# EAGLE design cloud-substrate (EAGLE 8.3.1)
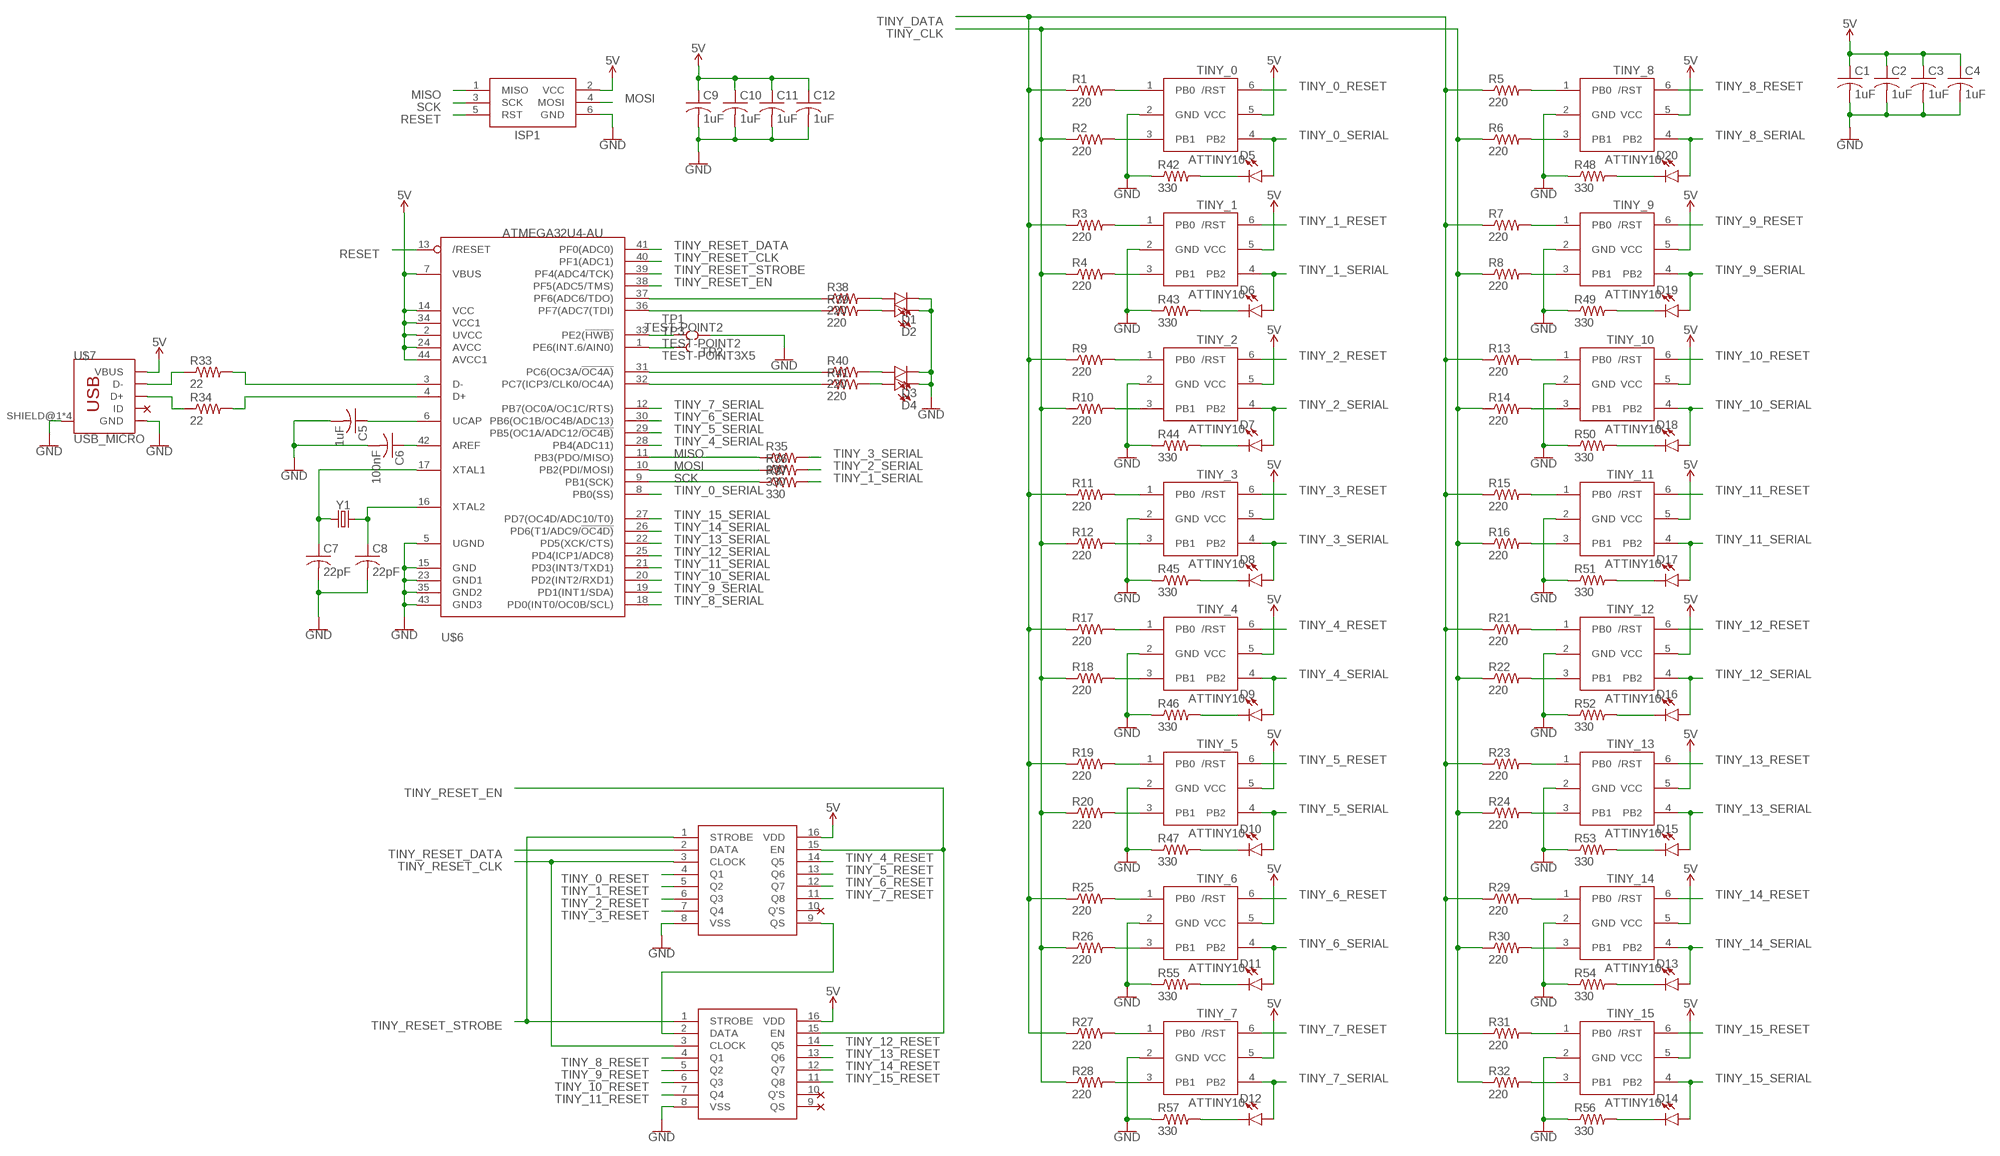
[diagram p0: schematic, sheet 1]

## Parts
C1  1uF  C-USC0805  [C0805]
C2  1uF  C-USC0805  [C0805]
C3  1uF  C-USC0805  [C0805]
C4  1uF  C-USC0805  [C0805]
C5  1uF  C-USC0402  [C0402]
C6  100nF  C-USC0402  [C0402]
C7  22pF  C-USC0402  [C0402]
C8  22pF  C-USC0402  [C0402]
C9  1uF  C-USC0805  [C0805]
C10  1uF  C-USC0805  [C0805]
C11  1uF  C-USC0805  [C0805]
C12  1uF  C-USC0805  [C0805]
D1  LED0603  [LED-0603]
D2  LED0603  [LED-0603]
D3  LED0603  [LED-0603]
D4  LED0603  [LED-0603]
D5  LED0603  [LED-0603]
D6  LED0603  [LED-0603]
D7  LED0603  [LED-0603]
D8  LED0603  [LED-0603]
D9  LED0603  [LED-0603]
D10  LED0603  [LED-0603]
D11  LED0603  [LED-0603]
D12  LED0603  [LED-0603]
D13  LED0603  [LED-0603]
D14  LED0603  [LED-0603]
D15  LED0603  [LED-0603]
D16  LED0603  [LED-0603]
D17  LED0603  [LED-0603]
D18  LED0603  [LED-0603]
D19  LED0603  [LED-0603]
D20  LED0603  [LED-0603]
ISP1  AVRISP-6  [AVRISP]
R1  220  R-US_R0402  [R0402]
R2  220  R-US_R0402  [R0402]
R3  220  R-US_R0402  [R0402]
R4  220  R-US_R0402  [R0402]
R5  220  R-US_R0402  [R0402]
R6  220  R-US_R0402  [R0402]
R7  220  R-US_R0402  [R0402]
R8  220  R-US_R0402  [R0402]
R9  220  R-US_R0402  [R0402]
R10  220  R-US_R0402  [R0402]
R11  220  R-US_R0402  [R0402]
R12  220  R-US_R0402  [R0402]
R13  220  R-US_R0402  [R0402]
R14  220  R-US_R0402  [R0402]
R15  220  R-US_R0402  [R0402]
R16  220  R-US_R0402  [R0402]
R17  220  R-US_R0402  [R0402]
R18  220  R-US_R0402  [R0402]
R19  220  R-US_R0402  [R0402]
R20  220  R-US_R0402  [R0402]
R21  220  R-US_R0402  [R0402]
R22  220  R-US_R0402  [R0402]
R23  220  R-US_R0402  [R0402]
R24  220  R-US_R0402  [R0402]
R25  220  R-US_R0402  [R0402]
R26  220  R-US_R0402  [R0402]
R27  220  R-US_R0402  [R0402]
R28  220  R-US_R0402  [R0402]
R29  220  R-US_R0402  [R0402]
R30  220  R-US_R0402  [R0402]
R31  220  R-US_R0402  [R0402]
R32  220  R-US_R0402  [R0402]
R33  22  R-US_R0402  [R0402]
R34  22  R-US_R0402  [R0402]
R35  330  R-US_R0402  [R0402]
R36  330  R-US_R0402  [R0402]
R37  330  R-US_R0402  [R0402]
R38  220  R-US_R0402  [R0402]
R39  220  R-US_R0402  [R0402]
R40  220  R-US_R0402  [R0402]
R41  220  R-US_R0402  [R0402]
R42  330  R-US_R0402  [R0402]
R43  330  R-US_R0402  [R0402]
R44  330  R-US_R0402  [R0402]
R45  330  R-US_R0402  [R0402]
R46  330  R-US_R0402  [R0402]
R47  330  R-US_R0402  [R0402]
R48  330  R-US_R0402  [R0402]
R49  330  R-US_R0402  [R0402]
R50  330  R-US_R0402  [R0402]
R51  330  R-US_R0402  [R0402]
R52  330  R-US_R0402  [R0402]
R53  330  R-US_R0402  [R0402]
R54  330  R-US_R0402  [R0402]
R55  330  R-US_R0402  [R0402]
R56  330  R-US_R0402  [R0402]
R57  330  R-US_R0402  [R0402]
TINY_0  ATTINY10  [SOT23-6]
TINY_1  ATTINY10  [SOT23-6]
TINY_2  ATTINY10  [SOT23-6]
TINY_3  ATTINY10  [SOT23-6]
TINY_4  ATTINY10  [SOT23-6]
TINY_5  ATTINY10  [SOT23-6]
TINY_6  ATTINY10  [SOT23-6]
TINY_7  ATTINY10  [SOT23-6]
TINY_8  ATTINY10  [SOT23-6]
TINY_9  ATTINY10  [SOT23-6]
TINY_10  ATTINY10  [SOT23-6]
TINY_11  ATTINY10  [SOT23-6]
TINY_12  ATTINY10  [SOT23-6]
TINY_13  ATTINY10  [SOT23-6]
TINY_14  ATTINY10  [SOT23-6]
TINY_15  ATTINY10  [SOT23-6]
TP1  TEST-POINT2  [PAD.02X.02]
TP2  TEST-POINT2  [PAD.02X.02]
TP3  TEST-POINT3X5  [PAD.03X.05]
U$1  CD4094B  [TSSOP16]
U$2  CD4094B  [TSSOP16]
U$6  ATMEGA32U4-AU  [TQFP44]
U$7  USB_MICRO  [USB_FCI_10118194]
Y1  CRYSTALSMD-3.2X2.5  [CRYSTAL-SMD-3.2X2.5MM]

## Nets
5V: C1.1 C2.1 C3.1 C4.1 C9.1 C10.1 C11.1 C12.1 ISP1.2(VCC) TINY_0.5(VCC) TINY_1.5(VCC) TINY_2.5(VCC) TINY_3.5(VCC) TINY_4.5(VCC) TINY_5.5(VCC) TINY_6.5(VCC) TINY_7.5(VCC) TINY_8.5(VCC) TINY_9.5(VCC) TINY_10.5(VCC) TINY_11.5(VCC) TINY_12.5(VCC) TINY_13.5(VCC) TINY_14.5(VCC) TINY_15.5(VCC) U$1.16(VDD) U$2.16(VDD) U$6.2(UVCC) U$6.7(VBUS) U$6.14(VCC) U$6.24(AVCC) U$6.34(VCC1) U$6.44(AVCC1) U$7.1(VBUS)
GND: C1.2 C2.2 C3.2 C4.2 C5.2 C6.2 C7.2 C8.2 C9.2 C10.2 C11.2 C12.2 D1.C D2.C D3.C D4.C ISP1.6(GND) R42.1 R43.1 R44.1 R45.1 R46.1 R47.1 R48.1 R49.1 R50.1 R51.1 R52.1 R53.1 R54.1 R55.1 R56.1 R57.1 TINY_0.2(GND) TINY_1.2(GND) TINY_2.2(GND) TINY_3.2(GND) TINY_4.2(GND) TINY_5.2(GND) TINY_6.2(GND) TINY_7.2(GND) TINY_8.2(GND) TINY_9.2(GND) TINY_10.2(GND) TINY_11.2(GND) TINY_12.2(GND) TINY_13.2(GND) TINY_14.2(GND) TINY_15.2(GND) TP2.P$1 U$1.8(VSS) U$2.8(VSS) U$6.5(UGND) U$6.15(GND) U$6.23(GND1) U$6.35(GND2) U$6.43(GND3) U$7.5(GND) U$7.SHIELD@1(SHIELD) U$7.SHIELD@2(SHIELD) U$7.SHIELD@3(SHIELD) U$7.SHIELD@4(SHIELD)
MISO: ISP1.1(MISO) R35.1 U$6.11(PB3(PDO/MISO))
MOSI: ISP1.4(MOSI) R36.1 U$6.10(PB2(PDI/MOSI))
N$1: R3.2 TINY_1.1(PB0)
N$2: R4.2 TINY_1.3(PB1)
N$3: R1.2 TINY_0.1(PB0)
N$4: R2.2 TINY_0.3(PB1)
N$5: R33.1 U$7.2(D-)
N$6: R34.1 U$7.3(D+)
N$7: R33.2 U$6.3(D-)
N$8: R34.2 U$6.4(D+)
N$9: U$1.9(QS) U$2.2(DATA)
N$10: R5.2 TINY_8.1(PB0)
N$11: R6.2 TINY_8.3(PB1)
N$12: C5.1 U$6.6(UCAP)
N$13: C6.1 U$6.42(AREF)
N$14: R7.2 TINY_9.1(PB0)
N$15: R8.2 TINY_9.3(PB1)
N$16: C7.1 U$6.17(XTAL1) Y1.1
N$17: C8.1 U$6.16(XTAL2) Y1.3
N$18: R9.2 TINY_2.1(PB0)
N$19: R10.2 TINY_2.3(PB1)
N$20: TP1.P$1 U$6.33(PE2(!HWB))
N$21: R38.1 U$6.37(PF6(ADC6/TDO))
N$22: R11.2 TINY_3.1(PB0)
N$23: R12.2 TINY_3.3(PB1)
N$24: R39.1 U$6.36(PF7(ADC7(TDI))
N$25: R40.1 U$6.31(PC6(OC3A/!OC4A))
N$26: R13.2 TINY_10.1(PB0)
N$27: R14.2 TINY_10.3(PB1)
N$28: R41.1 U$6.32(PC7(ICP3/CLK0/OC4A))
N$29: D1.A R38.2
N$30: R15.2 TINY_11.1(PB0)
N$31: R16.2 TINY_11.3(PB1)
N$32: D2.A R39.2
N$33: D3.A R40.2
N$34: R17.2 TINY_4.1(PB0)
N$35: R18.2 TINY_4.3(PB1)
N$36: D4.A R41.2
N$37: D7.C R44.2
N$38: R19.2 TINY_5.1(PB0)
N$39: R20.2 TINY_5.3(PB1)
N$40: TP3.P$1 U$6.1(PE6(INT.6/AIN0))
N$41: D8.C R45.2
N$42: R21.2 TINY_12.1(PB0)
N$43: R22.2 TINY_12.3(PB1)
N$44: D9.C R46.2
N$45: D10.C R47.2
N$46: R23.2 TINY_13.1(PB0)
N$47: R24.2 TINY_13.3(PB1)
N$48: D11.C R55.2
N$49: D12.C R57.2
N$50: R25.2 TINY_6.1(PB0)
N$51: R26.2 TINY_6.3(PB1)
N$52: D14.C R56.2
N$53: D13.C R54.2
N$54: R27.2 TINY_7.1(PB0)
N$55: R28.2 TINY_7.3(PB1)
N$56: D15.C R53.2
N$57: D16.C R52.2
N$58: R29.2 TINY_14.1(PB0)
N$59: R30.2 TINY_14.3(PB1)
N$60: D17.C R51.2
N$61: D18.C R50.2
N$62: R31.2 TINY_15.1(PB0)
N$63: R32.2 TINY_15.3(PB1)
N$64: D20.C R48.2
N$65: D19.C R49.2
N$66: D5.C R42.2
N$67: D6.C R43.2
RESET: ISP1.5(RST) U$6.13(/RESET)
SCK: ISP1.3(SCK) R37.1 U$6.9(PB1(SCK))
TINY_0_RESET: TINY_0.6(/RST) U$1.4(Q1)
TINY_0_SERIAL: D5.A TINY_0.4(PB2) U$6.8(PB0(SS))
TINY_1_RESET: TINY_1.6(/RST) U$1.5(Q2)
TINY_1_SERIAL: D6.A R37.2 TINY_1.4(PB2)
TINY_2_RESET: TINY_2.6(/RST) U$1.6(Q3)
TINY_2_SERIAL: D7.A R36.2 TINY_2.4(PB2)
TINY_3_RESET: TINY_3.6(/RST) U$1.7(Q4)
TINY_3_SERIAL: D8.A R35.2 TINY_3.4(PB2)
TINY_4_RESET: TINY_4.6(/RST) U$1.14(Q5)
TINY_4_SERIAL: D9.A TINY_4.4(PB2) U$6.28(PB4(ADC11))
TINY_5_RESET: TINY_5.6(/RST) U$1.13(Q6)
TINY_5_SERIAL: D10.A TINY_5.4(PB2) U$6.29(PB5(OC1A/ADC12/!OC4B))
TINY_6_RESET: TINY_6.6(/RST) U$1.12(Q7)
TINY_6_SERIAL: D11.A TINY_6.4(PB2) U$6.30(PB6(OC1B/OC4B/ADC13))
TINY_7_RESET: TINY_7.6(/RST) U$1.11(Q8)
TINY_7_SERIAL: D12.A TINY_7.4(PB2) U$6.12(PB7(OC0A/OC1C/RTS))
TINY_8_RESET: TINY_8.6(/RST) U$2.4(Q1)
TINY_8_SERIAL: D20.A TINY_8.4(PB2) U$6.18(PD0(INT0/OC0B/SCL))
TINY_9_RESET: TINY_9.6(/RST) U$2.5(Q2)
TINY_9_SERIAL: D19.A TINY_9.4(PB2) U$6.19(PD1(INT1/SDA))
TINY_10_RESET: TINY_10.6(/RST) U$2.6(Q3)
TINY_10_SERIAL: D18.A TINY_10.4(PB2) U$6.20(PD2(INT2/RXD1))
TINY_11_RESET: TINY_11.6(/RST) U$2.7(Q4)
TINY_11_SERIAL: D17.A TINY_11.4(PB2) U$6.21(PD3(INT3/TXD1))
TINY_12_RESET: TINY_12.6(/RST) U$2.14(Q5)
TINY_12_SERIAL: D16.A TINY_12.4(PB2) U$6.25(PD4(ICP1/ADC8))
TINY_13_RESET: TINY_13.6(/RST) U$2.13(Q6)
TINY_13_SERIAL: D15.A TINY_13.4(PB2) U$6.22(PD5(XCK/CTS))
TINY_14_RESET: TINY_14.6(/RST) U$2.12(Q7)
TINY_14_SERIAL: D13.A TINY_14.4(PB2) U$6.26(PD6(T1/ADC9/!OC4D))
TINY_15_RESET: TINY_15.6(/RST) U$2.11(Q8)
TINY_15_SERIAL: D14.A TINY_15.4(PB2) U$6.27(PD7(OC4D/ADC10/T0))
TINY_CLK: R2.1 R4.1 R6.1 R8.1 R10.1 R12.1 R14.1 R16.1 R18.1 R20.1 R22.1 R24.1 R26.1 R28.1 R30.1 R32.1
TINY_DATA: R1.1 R3.1 R5.1 R7.1 R9.1 R11.1 R13.1 R15.1 R17.1 R19.1 R21.1 R23.1 R25.1 R27.1 R29.1 R31.1
TINY_RESET_CLK: U$1.3(CLOCK) U$2.3(CLOCK) U$6.40(PF1(ADC1))
TINY_RESET_DATA: U$1.2(DATA) U$6.41(PF0(ADC0))
TINY_RESET_EN: U$1.15(EN) U$2.15(EN) U$6.38(PF5(ADC5/TMS))
TINY_RESET_STROBE: U$1.1(STROBE) U$2.1(STROBE) U$6.39(PF4(ADC4/TCK))
Unconnected: U$1.10(Q'S) U$2.9(QS) U$2.10(Q'S) U$7.4(ID)

## Library data of the parts
C1-C12 = adafruit:C-US: CAPACITOR, American symbol
D1-D20 = SparkFun-LED:LED: LED (Generic) Standard schematic elements and footprints for 5mm, 3mm, 1206, and 0603 sized LEDs. Generic LEDs with no color specified.
ISP1 = adafruit:AVRISP: AVR ISP HEADER Standard 6 pin header for AVR programming
R1-R57 = adafruit:R-US_: RESISTOR, American symbol
TINY_0 TINY_1-TINY_15 = adafruit:ATTINY10: ATtiny4/5/9/10 8-bit Microcontroller with 512/1024 Bytes In-System Programmable Flash
TP1-TP3 = SparkFun-Connectors:TEST-POINT: SparkFun Test Points Bare copper test points for troubleshooting or In-Circuit-Testing. These are used by our Production team for verifying production board runs using pogo-pins on test beds. SparkFun Products: SparkFun LSM9DS1 Breakout <https://www.sparkfun.com/products/13284> SparkFun PSOC <https://www.sparkfun.com/products/13714> SparkFun Load Cell Amplifier <https://www.sparkfun.com/products/13879>
U$1 U$2 = owen:CD4094B
U$6 = adafruit:ATMEGA32U4: http://www.ladyada.net/library/eagle
U$7 = owen:USB_MICRO
Y1 = SparkFun-Clocks:CRYSTAL: Crystals (Generic) These are passive quartz crystals, which can be used as a clock source for a microcontroller. Crystal's are two-terminal devices. They require external "load" capacitors to generate an oscillating signal.

## Board
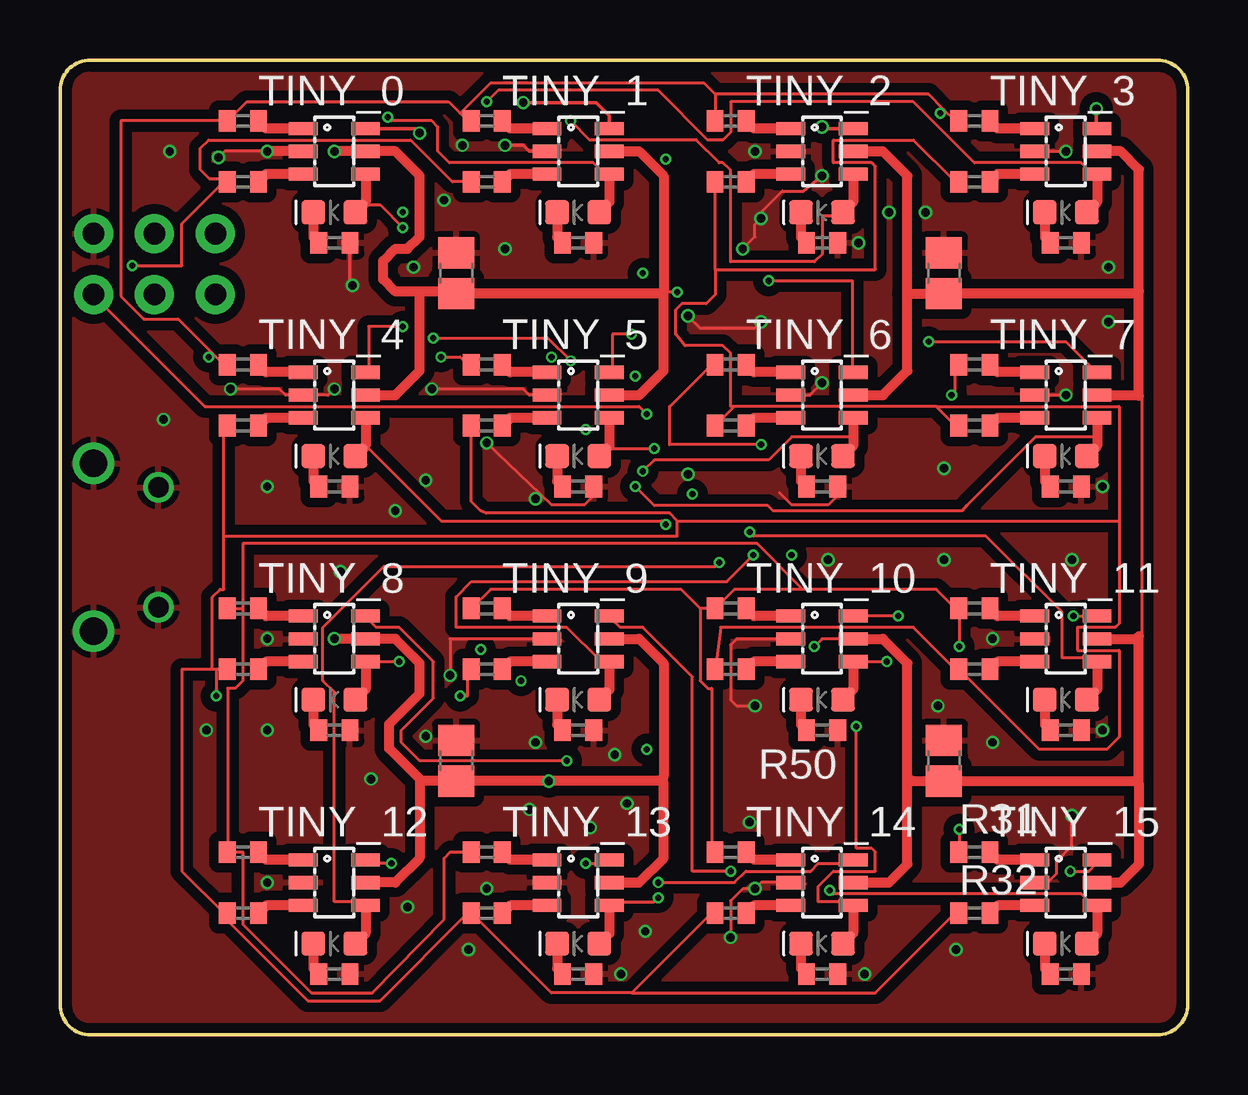
[diagram p1: board, top side]
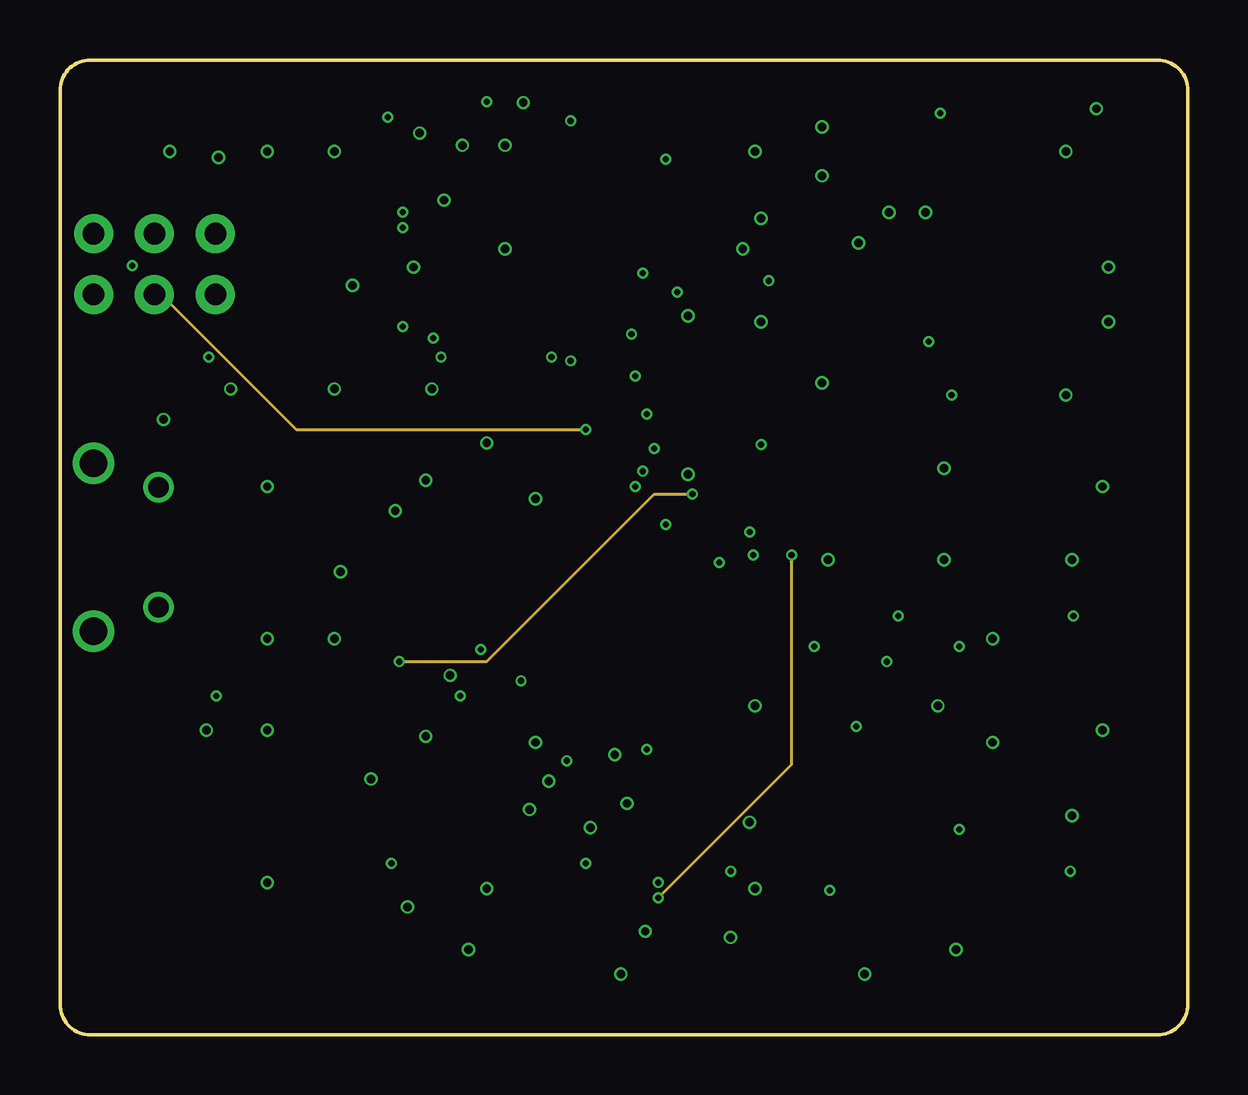
[diagram p2: board, inner layer Route2]
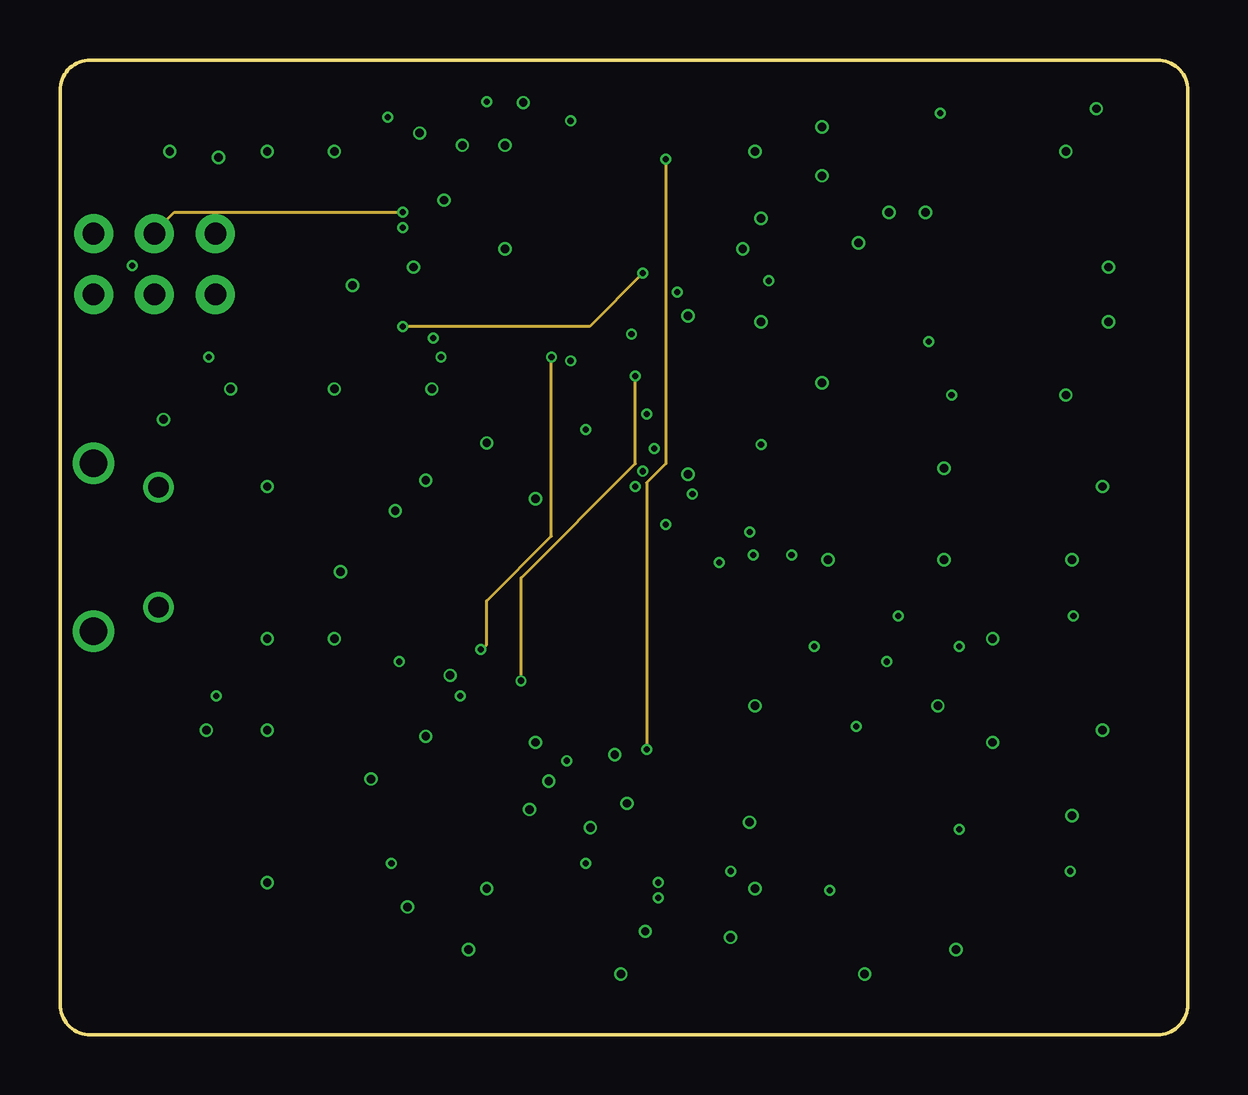
[diagram p3: board, inner layer Route15]
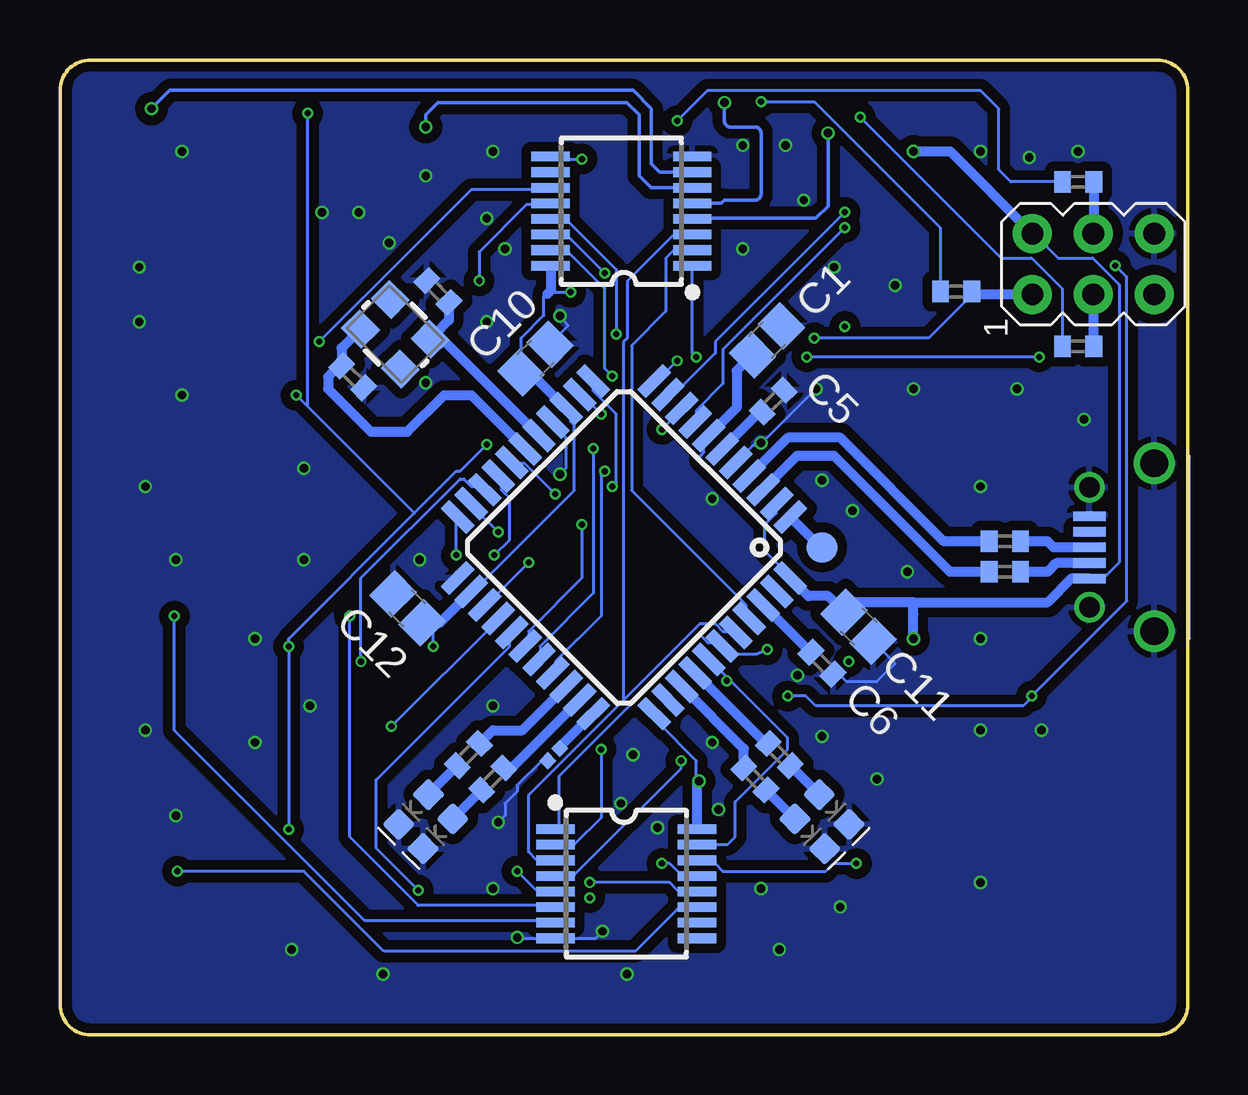
[diagram p4: board, bottom side, seen from below]

Size 46.99 x 40.64 mm. Coordinates in mm from the lower left corner, seen from the top.
Outline: 1.27,40.64 45.72,40.64 arc-90 46.99,39.37 46.99,1.27 arc-90 45.72,0 1.27,0 arc-90 0,1.27 0,39.37 arc-90 1.27,40.64
Copper layers (1*2*15*16): Top 0.035559375mm / dielectric 0.17018125mm / Route2 0.01778125mm / dielectric 47mil / Route15 0.01778125mm / dielectric 0.17018125mm / Bottom 0.035559375mm
Design rules "OSHPark-4layer": minimum track width 5mil, minimum drill 10mil, track to track 5mil, track to pad 5mil, pad to pad 5mil, via to via 5mil, smd to smd 5mil, copper to edge 15mil, drill to drill 6mil, minimum pad ring 4mil, minimum via ring 4mil, stop-mask expansion 2.5mil, vias tented up to drill 0mil, thermal gap 10mil

### Footprints (pad centres in the part's own frame; a part is rotated, then mirrored left to right if it is on the bottom)
C0805 = smd 1.3 x 1.5: 1 -0.85,0; 2 0.85,0
C0402 = smd 0.7 x 0.9: 1 -0.65,0; 2 0.65,0
LED-0603 = smd 1 x 1: A -0.877,0; C 0.877,0
AVRISP = drill 0.9 pad 1.626: 1 -1.27,2.54; 2 1.27,2.54; 3 -1.27,0; 4 1.27,0; 5 -1.27,-2.54; 6 1.27,-2.54
R0402 = smd 0.7 x 0.9: 1 -0.65,0; 2 0.65,0
SOT23-6 = smd 0.55 x 1.2: 1 -0.95,-1.3; 2 0,-1.3; 3 0.95,-1.3; 4 0.95,1.3; 5 0,1.3; 6 -0.95,1.3
PAD.02X.02 = smd 0.508 x 0.508: P$1 0,0
PAD.03X.05 = smd 1.27 x 1.27: P$1 0,0
TSSOP16 = smd 0.4 x 1.6: 1 -2.225,-2.85; 2 -1.575,-2.85; 3 -0.925,-2.85; 4 -0.275,-2.85; 5 0.375,-2.85; 6 1.025,-2.85; 7 1.675,-2.85; 8 2.325,-2.85; 9 2.325,3.05; 10 1.675,3.05; 11 1.025,3.05; 12 0.375,3.05; 13 -0.275,3.05; 14 -0.925,3.05; 15 -1.575,3.05; 16 -2.225,3.05
TQFP44 = smd 1.5 x 0.5: 1 -5.8,4; 2 -5.8,3.2; 3 -5.8,2.4; 4 -5.8,1.6; 5 -5.8,0.8; 6 -5.8,0; 7 -5.8,-0.8; 8 -5.8,-1.6; 9 -5.8,-2.4; 10 -5.8,-3.2; 11 -5.8,-4; 23 5.8,-4; 24 5.8,-3.2; 25 5.8,-2.4; 26 5.8,-1.6; 27 5.8,-0.8; 28 5.8,0; 29 5.8,0.8; 30 5.8,1.6; 31 5.8,2.4; 32 5.8,3.2; 33 5.8,4 | smd 0.5 x 1.5: 12 -4,-5.8; 13 -3.2,-5.8; 14 -2.4,-5.8; 15 -1.6,-5.8; 16 -0.8,-5.8; 17 0,-5.8; 18 0.8,-5.8; 19 1.6,-5.8; 20 2.4,-5.8; 21 3.2,-5.8; 22 4,-5.8; 34 4,5.8; 35 3.2,5.8; 36 2.4,5.8; 37 1.6,5.8; 38 0.8,5.8; 39 0,5.8; 40 -0.8,5.8; 41 -1.6,5.8; 42 -2.4,5.8; 43 -3.2,5.8; 44 -4,5.8
USB_FCI_10118194 = smd 0.4 x 1.35: 1 -1.3,2.7; 2 -0.65,2.7; 3 0,2.7; 4 0.65,2.7; 5 1.3,2.7 | drill 0.85: SHIELD@1 -2.5,2.7; SHIELD@2 2.5,2.7 | drill 1.15: SHIELD@3 -3.5,0; SHIELD@4 3.5,0
CRYSTAL-SMD-3.2X2.5MM = smd 1.2 x 1.1: 1 -1.175,-0.875; 2 1.175,-0.875; 3 1.175,0.875; 4 -1.175,0.875

### Placement (x,y rotation side)
C1  17.53,28.96 45 bottom
C2  16.51,11.43 90 top
C3  36.83,11.43 90 top
C4  36.83,31.75 90 top
C5  17.27,26.42 45 bottom
C6  15.24,15.49 315 bottom
C7  34.8,27.43 315 bottom
C8  31.24,30.99 135 bottom
C9  16.51,31.75 90 top
C10  27.18,28.19 45 bottom
C11  13.72,17.02 315 bottom
C12  32.51,17.78 135 bottom
D1  14.73,9.4 315 bottom
D2  15.75,8.38 315 bottom
D3  32.26,9.4 225 bottom
D4  31.24,8.38 225 bottom
D5  11.43,34.29 180 top
D6  21.59,34.29 180 top
D7  31.75,34.29 180 top
D8  41.91,34.29 180 top
D9  11.43,24.13 180 top
D10  21.59,24.13 180 top
D11  31.75,24.13 180 top
D12  41.91,24.13 180 top
D13  31.75,3.81 180 top
D14  41.91,3.81 180 top
D15  21.59,3.81 180 top
D16  11.43,3.81 180 top
D17  41.91,13.97 180 top
D18  31.75,13.97 180 top
D19  21.59,13.97 180 top
D20  11.43,13.97 180 top
ISP1  3.94,32.13 90 bottom
R1  7.62,38.1 0 top
R2  7.62,35.56 0 top
R3  17.78,38.1 0 top
R4  17.78,35.56 0 top
R5  7.62,17.78 0 top
R6  7.62,15.24 0 top
R7  17.78,17.78 0 top
R8  17.78,15.24 0 top
R9  27.94,38.1 0 top
R10  27.94,35.56 0 top
R11  38.1,38.1 0 top
R12  38.1,35.56 0 top
R13  27.94,17.78 0 top
R14  27.94,15.24 0 top
R15  38.1,17.78 0 top
R16  38.1,15.24 0 top
R17  7.62,27.94 0 top
R18  7.62,25.4 0 top
R19  17.78,27.94 0 top
R20  17.78,25.4 0 top
R21  7.62,7.62 0 top
R22  7.62,5.08 0 top
R23  17.78,7.62 0 top
R24  17.78,5.08 0 top
R25  27.94,27.94 0 top
R26  27.94,25.4 0 top
R27  38.1,27.94 0 top
R28  38.1,25.4 0 top
R29  27.94,7.62 0 top
R30  27.94,5.08 0 top
R31  38.1,7.62 0 top
R32  38.1,5.08 0 top
R33  7.62,19.3 180 bottom
R34  7.62,20.57 180 bottom
R35  9.65,30.99 180 bottom
R36  4.57,35.56 180 bottom
R37  4.57,28.7 180 bottom
R38  17.02,11.68 315 bottom
R39  18.03,10.67 315 bottom
R40  29.97,11.68 225 bottom
R41  28.96,10.67 225 bottom
R42  11.43,33.02 180 top
R43  21.59,33.02 180 top
R44  31.75,33.02 180 top
R45  41.91,33.02 180 top
R46  11.43,22.86 180 top
R47  21.59,22.86 180 top
R48  11.43,12.7 180 top
R49  21.59,12.7 180 top
R50  31.75,12.7 180 top
R51  41.91,12.7 180 top
R52  11.43,2.54 180 top
R53  21.59,2.54 180 top
R54  31.75,2.54 180 top
R55  31.75,22.86 180 top
R56  41.91,2.54 180 top
R57  41.91,22.86 180 top
TINY_0  11.43,36.83 270 top
TINY_1  21.59,36.83 270 top
TINY_2  31.75,36.83 270 top
TINY_3  41.91,36.83 270 top
TINY_4  11.43,26.67 270 top
TINY_5  21.59,26.67 270 top
TINY_6  31.75,26.67 270 top
TINY_7  41.91,26.67 270 top
TINY_8  11.43,16.51 270 top
TINY_9  21.59,16.51 270 top
TINY_10  31.75,16.51 270 top
TINY_11  41.91,16.51 270 top
TINY_12  11.43,6.35 270 top
TINY_13  21.59,6.35 270 top
TINY_14  31.75,6.35 270 top
TINY_15  41.91,6.35 270 top
TP1  26.16,11.94 315 bottom
TP2  26.67,11.43 315 bottom
TP3  15.24,20.32 0 bottom
U$1  23.5,34.29 90 bottom
U$2  23.5,6.35 270 bottom
U$6  23.5,20.32 225 bottom
U$7  1.4,20.32 90 bottom
Y1  33.02,29.21 315 bottom

### Tracks (layer width: path | path; a pad name or v marks a point on that pad's centre or on a via)
5V  (via drill 0.25, 0.35)
  Top 0.127: 25.15,30.8 25.24,30.8 25.12,30.9 25.24,30.96 v25.72,30.96 | v31.43,16.19 31.75,16.51 TINY_10.5 | 44.96,26.63 45.09,26.51 45.09,16.67 44.96,16.61
  Top 0.406: 25.09,10.58 v20.37,10.58 C2.1 15.08,10.58 14.99,10.67 | 44.96,30.99 44.87,30.9 C4.1 35.29,30.9 35.31,30.92 | 44.96,30.99 44.96,36.07 44.2,36.83 TINY_3.5 | TINY_15.5 44.2,6.35 44.96,7.11 44.96,10.46 | 44.96,10.46 44.96,16.61 44.86,16.51 TINY_11.5 | 44.96,30.99 44.96,26.63 44.92,26.67 TINY_7.5 | 14.99,30.99 13.97,30.99 13.46,31.5 13.46,32.26 13.97,32.77 14.48,32.77 14.99,33.27 14.99,35.81 13.97,36.83 TINY_0.5 v11.43,36.83 | 14.99,30.99 16.42,30.99 C9.1 25.12,30.9 25.15,30.93 25.15,35.81 24.13,36.83 TINY_1.5 | TINY_2.5 34.29,36.83 35.31,35.81 35.31,30.92 | TINY_4.5 13.97,26.67 14.99,27.69 14.99,30.99 | TINY_5.5 24.13,26.67 25.15,27.69 25.15,30.8 25.15,30.83 | TINY_6.5 34.29,26.67 35.31,27.69 35.31,30.92 | 44.96,10.46 44.84,10.58 C3.1 35.46,10.58 35.31,10.74 | 14.99,10.67 13.72,11.94 13.72,12.95 14.99,14.22 14.99,15.49 13.97,16.51 TINY_8.5 v11.43,16.51 | 14.99,10.67 14.99,7.37 13.97,6.35 TINY_12.5 | TINY_9.5 24.13,16.51 25.15,15.49 25.15,10.77 25.09,10.58 | TINY_10.5 34.29,16.51 35.31,15.49 35.31,10.74 | TINY_13.5 24.13,6.35 25.15,7.37 25.15,10.52 25.09,10.58 | TINY_14.5 34.54,6.35 35.31,7.11 35.31,10.74
  Bottom 0.127: U$6.34 22.07,13.33 22.07,13.02 20.48,11.43 20.48,10.64 v20.37,10.58 | 17.62,21.27 17.14,21.75 17.14,22.07 U$6.2 | 17.62,21.27 17.62,20.16 16.67,19.21 U$6.44 | 17.62,21.27 20.32,23.97 20.32,24.13 20.16,24.29 20.16,24.92 U$6.7 | 26.67,30.9 26.83,30.8 26.83,30 27.78,29.05 27.78,27.78 C10.1 | U$6.14 25.72,26.03 25.72,25.56 25.56,25.4 25.56,22.7 29.69,18.57 U$6.24 | v25.72,30.96 26.35,30.96 26.55,31.02 | v31.43,16.19 31.43,16.99 C12.1 | U$7.1 3.97,19.05 3.49,19.05 2.86,19.69 2.86,31.27 3.97,32.38 5.4,32.38 6.35,33.34 ISP1.2
  Bottom 0.406: C11.1 | C11.1 14.99,18.29 15.81,18.29 U$6.44 | U$6.7 18.8,26.15 18.8,27.69 C1.1 | C10.1 27.37,27.59 U$6.14 | C12.1 31.16,17.18 U$6.24 | C11.1 14.13,17.62 | U$7.1 4.86,19.02 5.84,18.03 11.43,18.03 | U$1.16 26.55,31.02 26.67,30.9 | U$2.16 20.45,10.5 v20.37,10.58 | C11.1 13.9,18.03 11.43,18.03 | v11.43,16.51 11.43,17.53 11.43,18.03 | v11.43,36.83 9.91,36.83 ISP1.2
GND  (via drill 0.35)
  Top 0.127: v8.64,36.83 6.86,36.83 v6.6,36.58 | TINY_3.2 v41.91,36.83 | TINY_7.2 v41.91,26.67 | TINY_15.2 41.15,6.35 41.53,6.73 41.53,7.24 42.16,7.87 v42.16,9.14 | v11.43,26.92 11.18,26.67 TINY_4.2 9.4,26.67 9.14,26.92 v7.11,26.92 | v31.75,35.81 30.99,35.18 30.1,35.18 29.21,34.29 v29.21,34.04 28.96,33.78 28.96,33.27 v28.45,32.77 | R55.1 32.4,22.49 32,22.1 30.48,22.1 29.97,22.61 | R47.1 22.24,22.49 21.84,22.1 20.48,22.1 v17.78,24.67 | TINY_5.2 19.56,26.67 19.3,26.92 v15.49,26.92 | TINY_9.2 16.26,16.51 v16.26,14.99 | TINY_6.2 31.24,26.67 v31.75,27.18 | TINY_14.2 29.21,6.35 v28.96,6.1 28.45,6.1 27.94,5.59 v27.94,4.06 | TINY_10.2 28.19,16.51 27.94,16.26 27.94,13.97 28.19,13.72 v28.96,13.72 | v26.16,29.97 26.67,29.46 28.96,29.46 v29.21,29.72
  Top 0.152: R42.1 12.08,31.35 v12.19,31.24 | TINY_1.2 19.56,36.83 19.3,37.08 v18.54,37.08
  Top 0.406: TINY_0.2 v8.64,36.83
  Bottom 0.127: 32.07,7.94 D4.C | C6.2 14.53,15.03 14.22,14.73 12.95,14.73 12.19,15.49 | 12.19,15.49 | 12.19,15.49 C11.2 | C10.2 25.81,29.56 v26.16,29.97 | U$6.15 26.47,25.45 25.91,24.89 25.91,23.62 v26.16,23.37 | U$6.5 18.14,24.55 v17.78,24.67 17.87,24.55 v15.49,26.92 | TP2.P$1 26.92,11.43 27.94,10.41 27.94,10.16 28.45,9.65 28.45,9.14 v28.73,8.86 | v27.94,4.06 27.9,4.02 U$2.8 24.68,4.02 v24.38,4.32
  other vias: 18.54,32.77 4.32,25.65 8.64,22.86 13.97,21.84 8.64,12.7 6.1,12.7 17.02,3.56 37.34,3.56 23.11,11.68 23.62,9.65 22.1,8.64 11.68,19.3 43.69,29.72 42.16,19.81 36.83,19.81 32,19.81 36.83,23.62 36.07,34.29 34.54,34.29 33.27,33.02 28.96,36.83 16,34.8 16.76,37.08 4.57,36.83 14.73,32 43.69,32 43.43,22.86 38.86,16.51 43.43,12.7 12.95,10.67 19.81,12.19 19.56,9.4 14.48,5.33 8.64,6.35 15.24,12.45 8.64,16.51 15.24,23.11 19.81,22.35 23.37,2.54 33.53,2.54 36.58,13.72 38.86,12.19 17.78,6.1
  pour Bottom (isolate 0.406): 0,39.37 0,1.27 arc90 1.27,0 45.72,0 arc90 46.99,1.27 46.99,39.37 arc90 45.72,40.64 1.27,40.64 arc90
  pour Top (isolate 0.406): 0,39.37 0,1.27 arc90 1.27,0 45.72,0 arc90 46.99,1.27 46.99,39.37 arc90 45.72,40.64 1.27,40.64 arc90
MISO  (via drill 0.25)
  Top 0.127: v21.27,28.1 20.32,29.05 v15.56,29.05
  Bottom 0.127: v21.27,28.1 22.07,27.3 U$6.11 | v15.56,29.05 10.8,29.05 9.05,30.8 R35.1
  Bottom 0.406: ISP1.1 8.88,30.86 R35.1
MOSI  (via drill 0.25)
  Route15 0.127: v14.29,34.29 4.76,34.29 3.97,33.5 ISP1.4
  Bottom 0.127: v14.29,34.29 19.69,28.89 19.69,28.42 21.27,26.83 21.59,26.83 U$6.10
  Bottom 0.406: R36.1 3.92,33.42 ISP1.4
N$1
  Top 0.406: TINY_1.1 18.75,37.78 R3.2
N$2
  Top 0.406: TINY_1.3 18.75,35.88 R4.2
N$3
  Top 0.406: TINY_0.1 8.59,37.78 R1.2
N$4
  Top 0.406: TINY_0.3 8.59,35.88 R2.2
N$5
  Bottom 0.406: U$7.2 5.48,19.67 5.84,19.3 R33.1
N$6
  Bottom 0.406: U$7.3 5.59,20.32 5.84,20.57 R34.1
N$7
  Bottom 0.406: U$6.3 16.29,24.13 14.73,24.13 9.91,19.3 R33.2
N$8
  Bottom 0.406: U$6.4 16.66,24.89 14.48,24.89 10.16,20.57 R34.2
N$9  (via drill 0.25)
  Route15 0.127: v24.45,11.91 24.45,23.02 25.24,23.81 v25.24,36.51
  Bottom 0.127: v24.45,11.91 24.45,9.05 25.56,7.94 26.19,7.94 U$2.2 | v25.24,36.51 26.51,36.51 U$1.9
N$10
  Top 0.406: TINY_8.1 8.59,17.46 R5.2
N$11
  Top 0.406: TINY_8.3 8.59,15.56 R6.2
N$12
  Bottom 0.406: C5.1 17.86,25.96 U$6.6
N$13
  Bottom 0.406: C6.1 15.73,15.95 U$6.42
N$14
  Top 0.406: TINY_9.1 18.75,17.46 R7.2
N$15
  Top 0.406: TINY_9.3 18.75,15.56 R8.2
N$16
  Bottom 0.406: Y1.1 35.26,28.63 C7.1 35.35,27.89 35.81,27.43 35.81,26.92 34.04,25.15 32.51,25.15 30.99,26.67 29.84,26.67 U$6.17
N$17
  Bottom 0.406: C8.1 30.78,29.79 31.31,29.26 | 31.31,29.26 Y1.3 | U$6.16 31.31,29.26
N$18
  Top 0.406: TINY_2.1 28.91,37.78 R9.2
N$19
  Top 0.406: TINY_2.3 28.91,35.88 R10.2
N$20
  Bottom 0.406: TP1.P$1 26.16,12 U$6.33
N$21
  Bottom 0.406: R38.1 17.58,12.14 U$6.37
N$22
  Top 0.406: TINY_3.1 39.07,37.78 R11.2
N$23
  Top 0.406: TINY_3.3 39.07,35.88 R12.2
N$24
  Bottom 0.406: R39.1 18.49,11.92 U$6.36
N$25
  Bottom 0.406: R40.1 28.96,12.7 27.72,12.7 U$6.31
N$26
  Top 0.406: TINY_10.1 28.91,17.46 R13.2
N$27
  Top 0.406: TINY_10.3 28.91,15.56 R14.2
N$28
  Bottom 0.406: R41.1 28.16,11.13 U$6.32
N$29
  Bottom 0.406: R38.2 D1.A
N$30
  Top 0.406: TINY_11.1 39.07,17.46 R15.2
N$31
  Top 0.406: TINY_11.3 39.07,15.56 R16.2
N$32
  Bottom 0.406: R39.2 D2.A
N$33
  Bottom 0.406: R40.2 D3.A
N$34
  Top 0.406: TINY_4.1 8.59,27.62 R17.2
N$35
  Top 0.406: TINY_4.3 8.59,25.72 R18.2
N$36
  Bottom 0.406: R41.2 D4.A
N$37
  Top 0.406: D7.C 30.87,33.25 R44.2
N$38
  Top 0.406: TINY_5.1 18.75,27.62 R19.2
N$39
  Top 0.406: TINY_5.3 18.75,25.72 R20.2
N$40
  Bottom 0.406: TP3.P$1 15.29,20.32 U$6.1
N$41
  Top 0.406: D8.C 41.03,33.25 R45.2
N$42
  Top 0.406: TINY_12.1 8.59,7.3 R21.2
N$43
  Top 0.406: TINY_12.3 8.59,5.4 R22.2
N$44
  Top 0.406: D9.C 10.55,23.09 R46.2
N$45
  Top 0.406: D10.C 20.71,23.09 R47.2
N$46
  Top 0.406: TINY_13.1 18.75,7.3 R23.2
N$47
  Top 0.406: TINY_13.3 18.75,5.4 R24.2
N$48
  Top 0.406: D11.C 30.87,23.09 R55.2
N$49
  Top 0.406: D12.C 41.03,23.09 R57.2
N$50
  Top 0.406: TINY_6.1 28.91,27.62 R25.2
N$51
  Top 0.406: TINY_6.3 28.91,25.72 R26.2
N$52
  Top 0.406: D14.C 41.03,2.77 R56.2
N$53
  Top 0.406: D13.C 30.87,2.77 R54.2
N$54
  Top 0.406: TINY_7.1 39.07,27.62 R27.2
N$55
  Top 0.406: TINY_7.3 39.07,25.72 R28.2
N$56
  Top 0.406: D15.C 20.71,2.77 R53.2
N$57
  Top 0.406: D16.C 10.55,2.77 R52.2
N$58
  Top 0.406: TINY_14.1 28.91,7.3 R29.2
N$59
  Top 0.406: TINY_14.3 28.91,5.4 R30.2
N$60
  Top 0.406: D17.C 41.03,12.93 R51.2
N$61
  Top 0.406: D18.C 30.87,12.93 R50.2
N$62
  Top 0.406: TINY_15.1 39.07,7.3 R31.2
N$63
  Top 0.406: TINY_15.3 39.07,5.4 R32.2
N$64
  Top 0.406: D20.C 10.55,12.93 R48.2
N$65
  Top 0.406: D19.C 20.71,12.93 R49.2
N$66
  Top 0.406: D5.C 10.55,33.25 R42.2
N$67
  Top 0.406: D6.C 20.71,33.25 R43.2
RESET  (via drill 0.25)
  Top 0.127: v24.45,25.88 24.13,26.19 6.03,26.19 1.43,30.8 ISP1.5
  Bottom 0.127: v24.45,25.88 25.24,26.67 U$6.13
SCK  (via drill 0.25)
  Route2 0.127: v21.91,25.24 9.84,25.24 4.29,30.8 3.97,30.8 ISP1.3
  Bottom 0.127: v21.91,25.24 21.11,26.03 U$6.9
  Bottom 0.406: R37.1 3.92,30.85 ISP1.3
TINY_0_RESET  (via drill 0.35)
  Top 0.152: TINY_0.6 14.8,37.78 v14.99,37.59
  Bottom 0.152: v14.99,37.59 14.99,34.54 15.49,34.04 20.62,34.04 U$1.4
TINY_0_SERIAL  (via drill 0.25)
  Top 0.127: v14.29,33.66 13.34,34.61 12.86,34.61 12.73,34.71
  Top 0.406: TINY_0.4 12.73,34.71 D5.A
  Bottom 0.127: v14.29,33.66 19.37,28.58 19.37,27.15 20.48,26.03 20.48,25.56 U$6.8
TINY_1_RESET  (via drill 0.35)
  Top 0.152: TINY_1.6 22.89,38.32 22.35,38.86 v19.3,38.86
  Bottom 0.152: U$1.5 19.44,34.66 19.3,34.8 18.03,34.8 arc-90 17.78,35.05 17.78,37.59 arc-90 18.03,37.85 19.05,37.85 arc90 19.3,38.1 v19.3,38.86
TINY_1_SERIAL  (via drill 0.25)
  Top 0.127: v13.65,38.26 13.81,38.1 15.49,38.1 15.75,37.85 15.75,36.83 16.22,36.35 22.23,36.35 22.7,35.88 TINY_1.4
  Top 0.406: TINY_1.4 22.89,34.71 D6.A
  Bottom 0.127: v13.65,38.26 7.78,32.38 6.51,32.38 5.24,31.11 5.24,28.73 R37.2
TINY_2_RESET  (via drill 0.35)
  Top 0.152: 33.02,37.81 TINY_2.6 31.82,37.78 v31.75,37.85
  Bottom 0.152: U$1.6 22.36,35.31 22.86,35.81 22.86,38.35 23.37,38.86 31.24,38.86 31.75,38.35 v31.75,37.85
TINY_2_SERIAL  (via drill 0.25)
  Top 0.127: v21.27,38.1 22.07,37.31 26.51,37.31 27.46,36.35 27.62,36.35 27.94,36.04 27.94,32.23 31.43,32.23 31.75,32.54 31.75,34.13 32.54,34.13 D7.A
  Top 0.406: TINY_2.4 33.05,34.71 D7.A
  Bottom 0.127: v21.27,38.1 20,39.37 8.64,39.37 7.87,38.61 7.87,36.07 7.37,35.56 R36.2
TINY_3_RESET  (via drill 0.35)
  Top 0.152: v43.18,38.61 43.18,37.81 TINY_3.6
  Bottom 0.152: U$1.7 22,35.97 22.35,36.32 22.35,38.61 23.11,39.37 42.42,39.37 v43.18,38.61
TINY_3_SERIAL  (via drill 0.25)
  Top 0.127: v17.78,38.89 18.26,39.37 24.92,39.37 26.99,37.31 27.62,37.31 27.94,37.62 27.94,38.89 35.56,38.89 38.1,36.35 42.55,36.35 43.02,35.88 TINY_3.4
  Top 0.406: TINY_3.4 43.21,34.71 D8.A
  Bottom 0.127: v17.78,38.89 15.56,38.89 10.32,33.66 10.32,31.11 R35.2
TINY_4_RESET  (via drill 0.25)
  Top 0.127: v14.29,29.53 12.86,29.53 12.86,27.62 TINY_4.6
  Route15 0.127: v14.29,29.53 22.07,29.53 v24.29,31.75
  Bottom 0.127: v24.29,31.75 25.88,33.34 26.51,33.34 U$1.14
TINY_4_SERIAL  (via drill 0.25)
  Top 0.127: v25.24,21.27 25.08,21.43 15.88,21.43 12.86,24.45 12.73,24.55
  Top 0.406: TINY_4.4 12.73,24.55 D9.A
  Bottom 0.127: v25.24,21.27 25.24,19.05 27.46,16.83 27.46,16.35 U$6.28
TINY_5_RESET  (via drill 0.25)
  Top 0.127: v23.81,29.21 23.02,29.21 23.02,27.62 TINY_5.6
  Bottom 0.127: v23.81,29.21 23.81,31.91 25.88,33.97 26.51,33.97 U$1.13
TINY_5_SERIAL  (via drill 0.25)
  Top 0.127: v24.77,24.45 23.02,24.45 22.89,24.55
  Top 0.406: TINY_5.4 22.89,24.55 D10.A
  Bottom 0.127: v24.77,24.45 24.77,18.41 26.99,16.19 26.99,15.72 U$6.29
TINY_6_RESET  (via drill 0.25)
  Top 0.127: v29.53,31.43 33.02,31.43 33.02,27.62 TINY_6.6
  Bottom 0.127: v29.53,31.43 29.53,32.64 27.56,34.61 26.67,34.61 U$1.12
TINY_6_SERIAL  (via drill 0.25)
  Top 0.127: v24.29,23.49 24.77,23.97 29.53,23.97 30.48,24.92 33.05,24.92
  Top 0.406: TINY_6.4 33.05,24.92 33.05,24.55 D11.A
  Bottom 0.127: v24.29,23.49 24.45,23.34 24.45,17.46 26.35,15.56 26.35,15.24 U$6.30
TINY_7_RESET  (via drill 0.25)
  Top 0.127: v36.2,28.89 41.91,28.89 43.18,27.62 TINY_7.6
  Bottom 0.127: v36.2,28.89 29.84,35.24 26.67,35.24 U$1.11
TINY_7_SERIAL  (via drill 0.25)
  Top 0.127: v23.97,22.86 24.77,22.07 29.5,22.07 29.72,21.84 37.59,21.84 37.78,22.07 40.64,24.92 43.21,24.92
  Top 0.406: TINY_7.4 43.21,24.92 43.21,24.55 D12.A
  Bottom 0.127: v23.97,22.86 23.81,23.02 23.81,25.88 24.77,26.83 24.77,27.15 U$6.12
TINY_8_RESET  (via drill 0.25)
  Top 0.127: v21.11,11.43 14.99,11.43 14.22,12.19 14.22,12.7 15.56,14.03 15.56,15.56 14.13,16.99 13.18,16.99 12.86,17.3 TINY_8.6
  Bottom 0.127: v21.11,11.43 21.11,11.11 25.56,6.67 26.19,6.67 U$2.4
TINY_8_SERIAL  (via drill 0.25)
  Top 0.127: v14.13,15.56 12.86,15.56 TINY_8.4
  Top 0.406: TINY_8.4 12.73,14.39 D20.A
  Route2 0.127: v26.35,22.54 24.77,22.54 17.78,15.56 v14.13,15.56
  Bottom 0.127: v26.35,22.54 27.62,23.81 28.1,23.81 U$6.18
TINY_9_RESET  (via drill 0.25)
  Top 0.127: v27.94,6.83 26.35,6.83 26.35,14.92 24.29,16.99 23.34,16.99 23.02,17.3 TINY_9.6
  Bottom 0.127: v27.94,6.83 27.15,6.03 26.35,6.03 U$2.5
TINY_9_SERIAL  (via drill 0.25)
  Top 0.127: v28.89,20 27.78,18.89 17.14,18.89 16.51,18.26 16.51,16.99 21.11,16.99 22.54,15.56 22.7,15.56 TINY_9.4
  Top 0.406: TINY_9.4 22.89,14.39 D19.A
  Bottom 0.127: v28.89,20 28.26,20.64 28.26,22.38 28.58,22.7 28.58,23.18 U$6.19
TINY_10_RESET  (via drill 0.25)
  Top 0.127: v34.92,17.46 33.18,17.46 TINY_10.6
  Bottom 0.127: v34.92,17.46 34.92,8.25 32.07,5.4 26.35,5.4 U$2.6
TINY_10_SERIAL  (via drill 0.25)
  Top 0.127: v34.45,15.56 33.18,15.56 TINY_10.4
  Top 0.406: TINY_10.4 33.05,14.39 D18.A
  Bottom 0.127: v34.45,15.56 34.45,19.05 30.32,23.18 30.16,23.18 29.84,22.86 29.37,22.86 U$6.20
TINY_11_RESET  (via drill 0.25)
  Top 0.127: v42.23,17.46 43.18,17.46 TINY_11.6
  Bottom 0.127: v42.23,17.46 42.23,12.7 34.29,4.76 26.35,4.76 U$2.7
TINY_11_SERIAL  (via drill 0.25)
  Top 0.127: v28.73,20.95 28.89,20.8 38.58,20.8 41.75,17.62 41.75,15.72 43.18,15.72 TINY_11.4
  Top 0.406: TINY_11.4 43.21,14.39 D17.A
  Bottom 0.127: v28.73,20.95 29.84,22.07 U$6.21
TINY_12_RESET  (via drill 0.25)
  Top 0.127: v13.81,7.14 12.86,7.14 TINY_12.6
  Bottom 0.127: v13.81,7.14 14.76,7.14 15.08,6.83 19.37,6.83 19.69,7.14 20.32,7.14 U$2.14
TINY_12_SERIAL  (via drill 0.25)
  Top 0.127: v27.46,19.69 27.31,19.53 13.49,19.53 10.95,16.99 10.95,14.76 11.43,14.29 11.43,5.56 12.7,5.56 TINY_12.4
  Top 0.406: TINY_12.4 12.73,4.23 D16.A
  Bottom 0.127: v27.46,19.69 29.21,17.94 U$6.25
TINY_13_RESET  (via drill 0.25)
  Top 0.127: v21.91,7.14 22.86,7.14 TINY_13.6
  Bottom 0.127: v21.91,7.14 21.59,7.14 21.11,6.67 20.48,6.67 U$2.13
TINY_13_SERIAL  (via drill 0.25)
  Top 0.127: v24.92,5.71 24.77,5.56 23.02,5.56 TINY_13.4
  Top 0.406: TINY_13.4 22.89,4.23 D15.A
  Route2 0.127: v30.48,20 30.48,11.27 v24.92,5.71
  Bottom 0.127: v30.48,20 30.48,21.59 U$6.22
TINY_14_RESET  (via drill 0.25)
  Top 0.127: v24.92,6.35 28.1,6.35 28.58,6.83 31.27,6.83 31.59,7.14 33.02,7.14 TINY_14.6
  Bottom 0.127: v24.92,6.35 21.59,6.35 21.27,6.03 20.48,6.03 U$2.12
TINY_14_SERIAL  (via drill 0.25)
  Top 0.127: v33.18,12.86 33.18,7.78 33.81,7.78 33.97,7.62 33.97,6.83 32.23,6.83 31.59,6.19 31.59,5.56 33.02,5.56 TINY_14.4
  Top 0.406: TINY_14.4 33.05,4.23 D13.A
  Bottom 0.127: v33.18,12.86 28.73,17.3 U$6.26
TINY_15_RESET  (via drill 0.25)
  Top 0.127: v42.1,6.83 42.86,6.83 43.18,7.14 TINY_15.6
  Bottom 0.127: v42.1,6.83 36.83,6.83 33.5,3.49 23.02,3.49 21.27,5.24 20.48,5.24 U$2.11
TINY_15_SERIAL  (via drill 0.25)
  Top 0.127: v32.07,6.03 32.23,5.87 42.55,5.87 43.02,5.4 TINY_15.4
  Top 0.406: TINY_15.4 43.21,4.23 D14.A
  Bottom 0.127: v32.07,6.03 33.81,7.78 33.81,10.64 28.26,16.19 28.26,16.67 U$6.27
TINY_CLK  (via drill 0.25)
  Top 0.127: R14.1 27.31,15.24 27.53,16.99 35.56,16.99 37.31,15.24 R16.1 37.47,15.24 40.8,11.91 43.62,11.91 44.13,12.41 44.13,16.03 42.39,16.03 42.39,16.99 43.97,16.99 44.13,17.14 44.13,21.43 | 28.1,26.19 27.31,25.4 R26.1 | 36.51,26.19 28.1,26.19 | 36.51,26.19 37.31,25.4 R28.1 | 27.31,31.91 27.31,35.56 R10.1 | 28.1,26.19 27.94,26.19 27.94,28.42 27.62,28.73 26.03,28.73 25.65,29.21 25.65,30.23 25.91,30.48 26.92,30.48 27.31,30.86 27.31,31.91 | 27.31,31.91 33.97,31.91 33.97,36.19 33.81,36.35 32.23,36.35 32.23,37.31 35.56,37.31 37.31,35.56 R12.1 | 44.13,21.43 44.13,26.19 36.51,26.19 | 23.81,1.75 20.48,1.75 17.14,5.08 R24.1 16.99,5.08 13.34,1.43 10.32,1.43 6.98,4.76 6.98,5.08 R22.1 6.83,5.08 5.08,6.83 5.08,15.24 6.35,15.24 | 23.81,1.75 27.15,5.08 R30.1 | 23.81,1.75 33.97,1.75 37.31,5.08 R32.1 | R4.1 16.35,35.56 14.61,37.31 6.19,37.31 5.84,36.96 5.84,36.07 6.22,35.69 6.95,35.69 6.83,35.56 | 6.98,35.56 R2.1 6.83,35.56 | R6.1 6.51,15.24 | 6.51,15.24 6.35,15.24 | v16.67,14.13 16.99,14.13 16.99,15.24 R8.1 | 6.51,15.24 v6.51,14.13 | 6.83,20.8 6.83,18.57 6.67,18.57 6.35,18.26 6.35,15.24 | 6.83,20.8 6.83,25.4 R18.1 | 25.72,21.43 25.4,21.75 17.75,21.75 17.53,21.84 17.14,22.22 17.14,25.4 R20.1 | 25.72,21.43 25.72,20.8 6.83,20.8 | 6.83,35.56 5.08,33.81 5.08,32.07 v3.02,32.07 | 25.72,21.43 44.13,21.43
  Bottom 0.127: v16.67,14.13 15.91,14.13 15.49,13.72 6.86,13.72 6.6,13.97 v6.51,14.13 2.54,18.1 2.54,31.59 v3.02,32.07
TINY_DATA  (via drill 0.25)
  Top 0.127: 27.31,39.21 27.31,38.1 R9.1 | 27.31,39.21 36.2,39.21 36.83,38.58 | 36.83,38.58 37.31,38.1 R11.1 | 6.35,28.42 4.92,29.84 3.49,29.84 2.54,30.8 2.54,38.1 R1.1 6.98,38.1 7.78,38.89 16.19,38.89 16.67,38.42 | 6.35,28.42 6.83,27.94 R17.1 | v15.88,28.26 16.67,28.26 16.99,27.94 R19.1 | 6.35,28.42 v6.19,28.26 | 16.67,38.42 16.99,38.1 R3.1 | 27.31,39.21 26.83,39.69 17.94,39.69 16.67,38.42 | 6.98,7.62 6.98,14.45 7.3,14.45 7.62,14.76 7.62,17.78 | R5.1 7.62,17.78 | 6.98,7.62 7.62,7.62 7.62,4.6 10.48,1.75 13.02,1.75 16,4.83 16,7.37 16.26,7.62 17.04,7.62 | 17.04,7.62 16.99,7.62 | 17.04,7.62 R23.1 | 6.98,7.62 R21.1 | 26.67,17.78 26.67,14.76 26.99,14.45 27.15,14.45 27.15,7.62 R29.1 | 26.67,17.78 R13.1 27.31,17.78 28.1,18.57 30.96,18.57 | 26.67,17.78 25.88,18.57 17.94,18.57 17.14,17.78 R7.1 | v37.47,8.57 37.47,7.62 R31.1 | v37.47,16.19 37.47,17.78 R15.1 37.31,17.78 36.51,18.57 30.96,18.57 | v29.21,24.61 25.4,24.61 25.4,26.19 27.15,27.94 R25.1 | v37.15,26.67 37.31,26.67 37.31,27.94 R27.1 | 7.62,17.78 7.62,20.48 29.05,20.48 30.96,18.57 | v36.67,38.42 36.83,38.58
  Bottom 0.127: v6.19,28.26 v15.88,28.26 | v37.47,8.57 v37.47,16.19 37.47,16.51 32.23,21.75 | v29.21,24.61 30.32,23.49 30.48,23.49 32.23,21.75 | 32.23,21.75 36.67,26.19 | 36.67,26.19 v37.15,26.67 | 36.67,26.19 v36.67,38.42
TINY_RESET_CLK
  Bottom 0.127: 23.5,13.97 27.46,10 27.46,7.62 27.15,7.3 26.35,7.3 U$2.3 | 23.5,13.97 20.32,17.14 19.69,17.14 19.37,16.83 18.89,16.83 U$6.40 | 23.5,13.97 23.5,28.89 23.34,29.05 23.34,31.43 21.43,33.34 20.8,33.34 U$1.3
TINY_RESET_DATA
  Bottom 0.127: U$6.41 18.42,17.46 18.42,17.94 23.18,22.7 23.18,28.73 21.75,30.16 21.75,32.38 21.43,32.7 20.8,32.7 U$1.2
TINY_RESET_EN  (via drill 0.25)
  Route15 0.127: v23.97,27.46 23.97,23.81 19.21,19.05 v19.21,14.76
  Bottom 0.127: 19.05,14.76 16.67,12.38 16.67,11.91 18.86,9.72 18.86,8.25 19.18,7.94 20.32,7.94 U$2.15 | 19.05,14.76 19.84,15.56 U$6.38 | v23.97,27.46 24.29,27.78 24.29,31.11 25.88,32.7 26.51,32.7 U$1.15 | 19.05,14.76 v19.21,14.76
TINY_RESET_STROBE  (via drill 0.25)
  Route15 0.127: v20.48,28.26 20.48,20.8 17.78,18.1 17.78,16.26 17.59,16.07 v17.53,16.07
  Bottom 0.127: U$2.1 26.19,8.73 26.19,10.79 20.32,16.67 20,16.35 19.53,16.35 U$6.39 19.37,16.19 19.05,15.88 17.97,15.88 v17.53,16.07 | v20.48,28.26 20.64,28.42 20.64,31.91 U$1.1